# Altium schematic sheet IMU_GNSS.SchDoc
size 400 x 200 mm; SheetNumber: 6; SheetTotal: 7
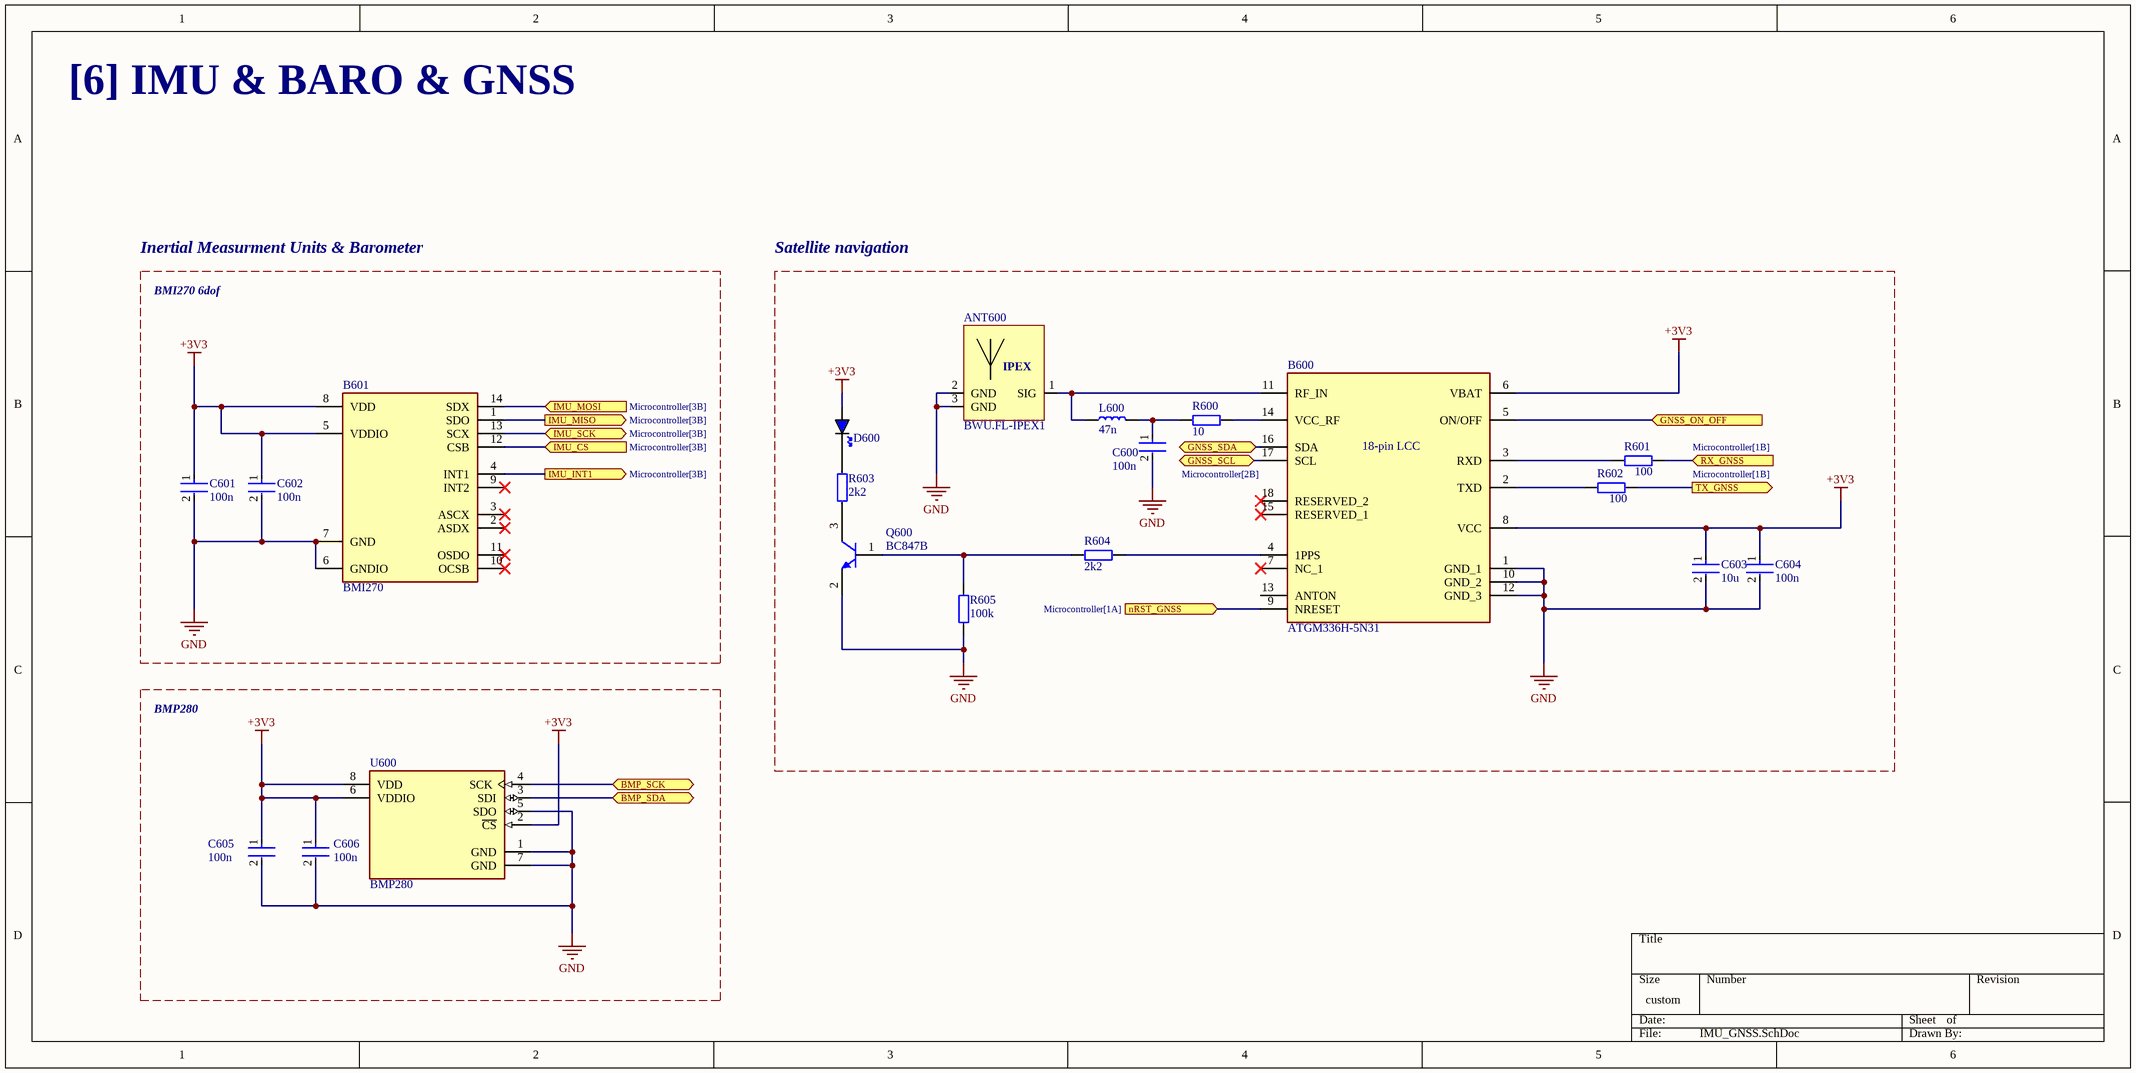
[diagram p0: IMU_GNSS.SchDoc]

## Parts
ANT600  BWU.FL-IPEX1  [BWU.FL-IPEX1]
B600  ATGM336H-5N31  [ATGM336H5N31]
B601  BMI270  [QFN50P300X250X87-14N]
C600  100n  [FP-CL779-IPC_C]
C601  100n  [FP-CL779-IPC_C]
C602  100n  [FP-CL779-IPC_C]
C603  10u  [FP-CL10-IPC_C]
C604  100n  [FP-CL779-IPC_C]
C605  100n  [FP-CL779-IPC_C]
C606  100n  [FP-CL779-IPC_C]
D600  BLUE  [LED_0603_BLUE]  (value not drawn)
L600  47n  [IND_0603]
Q600  BC847B  [INF-SOT23_M]
R600  10  [RES_0603]
R601  100  [RES_0603]
R602  100  [RES_0603]
R603  2k2  [RES_0603]
R604  2k2  [RES_0603]
R605  100k  [RES_0603]
U600  BMP280  [FP-BMP280-MFG]

## Blocks framed on the sheet
Inertial Measurment Units & Barometer: B601 C601 C602
Satellite navigation: ANT600 B600 C600 C603 C604 D600 L600 Q600 R600-R605
BMP280: C605 C606 U600

## Ports
BMP_SCK (bidir), BMP_SDA (bidir), GNSS_ON_OFF (in), GNSS_SCL (bidir, see Microcontroller[2B]), GNSS_SDA (bidir, see Microcontroller[3A]), IMU_CS (in, see Microcontroller[3B]), IMU_INT1 (out, see Microcontroller[3B]), IMU_MISO (out, see Microcontroller[3B]), IMU_MOSI (in, see Microcontroller[3B]), IMU_SCK (bidir, see Microcontroller[3B]), nRST_GNSS (in, see Microcontroller[1A]), RX_GNSS (in, see Microcontroller[1B]), TX_GNSS (out, see Microcontroller[1B])

## Nets
+3V3: B600.6(VBAT) B600.8(VCC) B601.5(VDDIO) B601.8(VDD) C601.1 C602.1 C603.1 C604.1 C605.1 C606.1 D600.A U600.2(~{CS}) U600.6(VDDIO) U600.8(VDD)
GND: ANT600.2(GND) ANT600.3(GND) B600.1(GND_1) B600.10(GND_2) B600.12(GND_3) B601.6(GNDIO) B601.7(GND) C600.2 C601.2 C602.2 C603.2 C604.2 C605.2 C606.2 Q600.2(E) R605.1 U600.1(GND) U600.5(SDO) U600.7(GND)
BMP_SCK: U600.4(SCK) ; port BMP_SCK
BMP_SDA: U600.3(SDI) ; port BMP_SDA
GNSS_ON_OFF: B600.5(ON/OFF) ; port GNSS_ON_OFF
GNSS_SCL: B600.17(SCL) ; port GNSS_SCL
GNSS_SDA: B600.16(SDA) ; port GNSS_SDA
IMU_CS: B601.12(CSB) ; port IMU_CS
IMU_INT1: B601.4(INT1) ; port IMU_INT1
IMU_MISO: B601.1(SDO) ; port IMU_MISO
IMU_MOSI: B601.14(SDX) ; port IMU_MOSI
IMU_SCK: B601.13(SCX) ; port IMU_SCK
nRST_GNSS: B600.9(NRESET) ; port nRST_GNSS
RX_GNSS: R601.2 ; port RX_GNSS
TX_GNSS: R602.2 ; port TX_GNSS
NetANT600_1: ANT600.1(SIG) B600.11(RF_IN) L600.1
NetB600_2: B600.2(TXD) R602.1
NetB600_3: B600.3(RXD) R601.1
NetB600_4: B600.4(1PPS) R604.2
NetB600_14: B600.14(VCC_RF) R600.2
NetC600_1: C600.1 L600.2 R600.1
NetD600_K: D600.K R603.2
NetQ600_1: Q600.1(B) R604.1 R605.2
NetQ600_3: Q600.3(C) R603.1

Not connected (* = marked no-connect by the designer): B600 7(NC_1)* 13(ANTON) 15(RESERVED_1)* 18(RESERVED_2)*; B601 2(ASDX)* 3(ASCX)* 9(INT2)* 10(OCSB)* 11(OSDO)*

## Notes on the sheet
- [6] IMU & BARO & GNSS
- BMI270 6dof
- (in symbol ATGM336H-5N31) 18-pin LCC
- (in symbol BWU.FL-IPEX1) IPEX

## Library data of the parts
ANT600 = BWU.FL-IPEX1: IPEX conn Antenna 2.4GHz 50Ohm
B600 = ATGM336H-5N31: GSM & GPRS & GPS Modules 9.7X10.1mm RoHS; Manufacturer_Name: ZHONGKEWEI; Geometry.Height: 2.6mm; Manufacturer_Part_Number: ATGM336H-5N31; Mouser Part Number: *; Mouser Price/Stock: *; Arrow Part Number: *; Arrow Price/Stock: *; Datasheet Link: https://datasheet.lcsc.com/szlcsc/ZHONGKEWEI-ATGM336H-5N31_C90770.pdf
B601 = BMI270: IMUs - Inertial Measurement Units Smart Ultra-Low Power Inertial Measurement Unit (IMU) for Wearable Applications; Manufacturer_Name: BOSCH; Geometry.Height: 0.87mm; Mouser Part Number: 262-BMI270; Mouser Price/Stock: https://www.mouser.co.uk/ProductDetail/Bosch-Sensortec/BMI270?qs=u16ybLDytRYIj%252BjQEee88A%3D%3D; Manufacturer_Part_Number: BMI270; Datasheet Link: https://www.mouser.de/datasheet/2/783/BST-BMI270-FL000-1530947.pdf
C600-C602 C604-C606 = CMP-13271-002336-1: Cap Ceramic 100nF 50V X7R ±10% SMD 0402 +125°C Paper T/R CL05B104KB54PNC
C603 = CMP-13271-004224-1: Cap Ceramic 10uF 25V X5R ±20% Pad SMD 0603 +85°C T/R; Width: 0.031inch; Voltage Rating: 25V; Length: 0.063inch; Case Code (Metric): 1608; Dielectric: X5R; Termination: Wraparound; Capacitance: 10uF; Lead Free: Lead Free; Mount: Surface Mount; Package Quantity: 1; Case Code (Imperial): 0603; Thickness: 0.035inch; Packaging: Tape and Reel; Contact Plating: Tin; Min Operating Temperature: -55°C; Tolerance: 20%; Max Operating Temperature: 85°C; Case/Package: 0603
D600 = LED_0603_BLUE: LED 0603 BLUE SMD
L600 = IND_0603: Inductor SMD 0603
Q600 = CMP-1177-00042-1: NPN Silicon AF Transistor, 45 V VCEO, 100 mA IC, SOT23, Reel, Green; Manufacturer: Infineon; VEBO (max): 6Â V; ICBO (max): 15Â nA; VCBO (max): 50Â V; IBM (max): 200Â mA; Green: TRUE; Ptot (max): 330Â mW; fT (typ): 250Â MHz; IC (max): 100Â mA; VCEO (max): 45Â V; PackageDescription: 3-Pin Small Outline Transistor Package, 1.3 x 2.9 mm Body, 0.95 mm Pitch; ComponentLink3URL: http://www.infineon.com/dgdl/SOT23-Package_Overview.pdf?folderId=db3a30431936bc4b0119532290053c66&fileId=db3a30431936bc4b0119533468123c85; PackageVersion: Apr-08; Packing: Reel; ComponentLink3Description: Package Specification; ComponentLink2URL: http://www.infineon.com/dgdl/bc847series_bc848series_bc849series_bc850series.pdf?folderId=db3a304314dca389011541d30fa21656&fileId=db3a304314dca389011541d4630a1657; ComponentLink1URL: http://www.infineon.com/; ComponentLink2Description: Datasheet; Polarity: NPN; Mounting Technology: Surface Mount; PackageReference: SOT23; ICM (max): 200Â mA; ComponentLink1Description: Manufacturer URL; PartNumber: BC847B
R600-R605 = RES_0603: Resistor SMD 0603; Manufacturer: *; Manufacturer Part Number: *; Distributor Link: *; LCSC: *
U600 = CMP-2000-05076-3: SENSOR PRESSURE ABS; Operating Pressure: 15.95PSI; Pressure Type: Absolute; Output Type: SPI; Max Pressure: 290.08PSI; Port Style: No Port; Case/Package: SMD/SMT; Lead Free: Lead Free; Termination: SMD/SMT; Min Operating Temperature: -40°C; Number of Pins: 8; Max Operating Temperature: 85°C